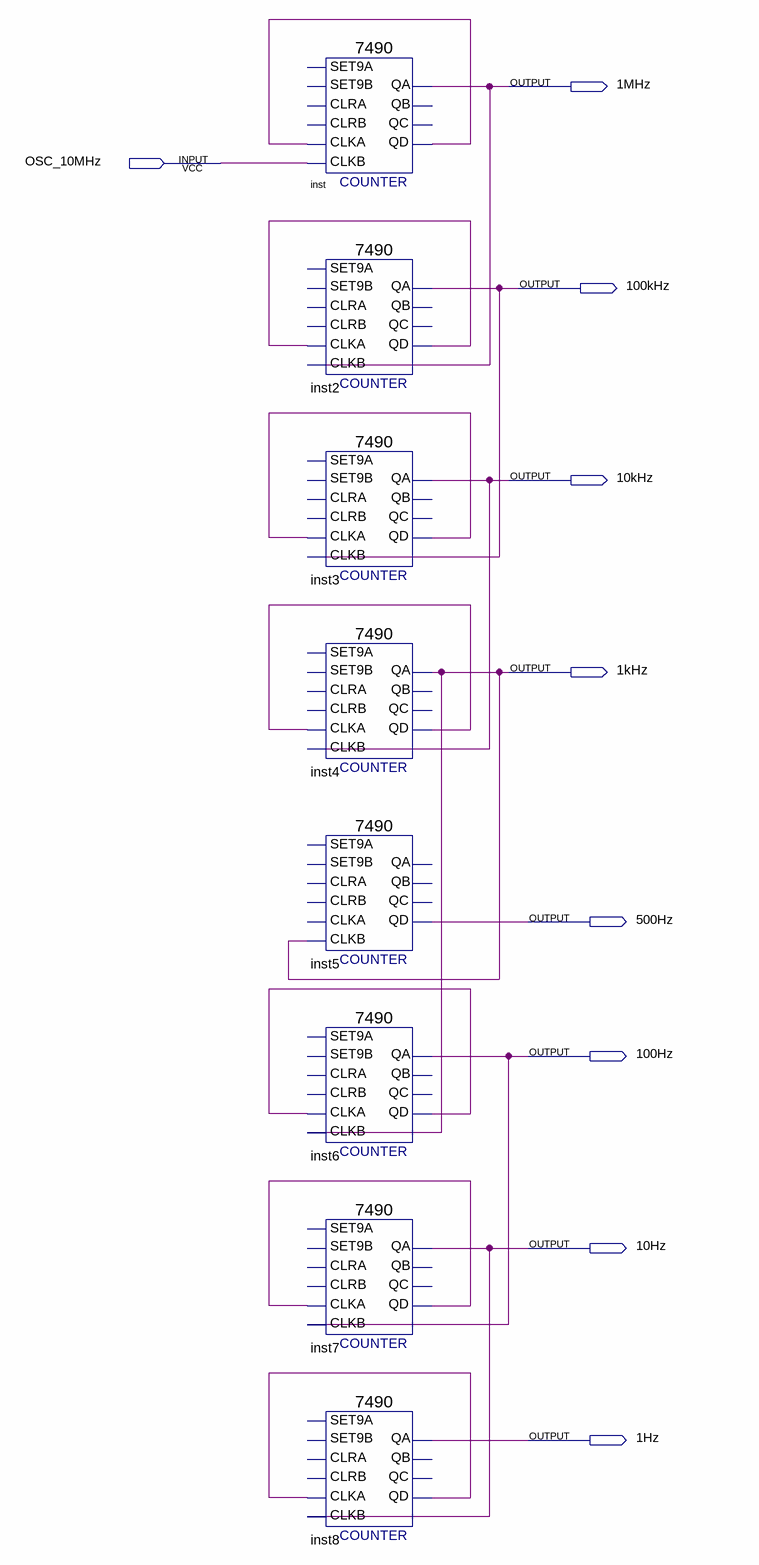
[diagram p0: schematic sheet]
// Quartus schematic FrequencyDivider.bdf as structural Verilog: 8 symbols, 9 pins
module FrequencyDivider (
  input  OSC_10MHz,
  output \1MHz ,
  output \100kHz ,
  output \10kHz ,
  output \1kHz ,
  output \500Hz ,
  output \100Hz ,
  output \10Hz ,
  output \1Hz 
);

  wire inst2_qd, inst3_qd, inst4_qd, inst6_qd, inst7_qd, inst8_qd, inst_qd;

  \7490  inst (.CLKB(OSC_10MHz), .CLKA(inst_qd), .QD(inst_qd), .QA(\1MHz ));  // open: SET9A, CLRA, SET9B, CLRB, QB, QC
  \7490  inst2 (
    .CLKB(\1MHz ), .CLKA(inst2_qd), .QD(inst2_qd), .QA(\100kHz ));  // open: SET9A, CLRA, SET9B, CLRB, QB, QC
  \7490  inst3 (
    .CLKB(\100kHz ), .CLKA(inst3_qd), .QD(inst3_qd), .QA(\10kHz ));  // open: SET9A, CLRA, SET9B, CLRB, QB, QC
  \7490  inst4 (.CLKB(\10kHz ), .CLKA(inst4_qd), .QD(inst4_qd), .QA(\1kHz ));  // open: SET9A, CLRA, SET9B, CLRB, QB, QC
  \7490  inst5 (.CLKB(\1kHz ), .QD(\500Hz ));  // open: SET9A, CLRA, SET9B, CLKA, CLRB, QA, QB, QC
  \7490  inst6 (.CLKB(\1kHz ), .CLKA(inst6_qd), .QD(inst6_qd), .QA(\100Hz ));  // open: SET9A, CLRA, SET9B, CLRB, QB, QC
  \7490  inst7 (.CLKB(\100Hz ), .CLKA(inst7_qd), .QD(inst7_qd), .QA(\10Hz ));  // open: SET9A, CLRA, SET9B, CLRB, QB, QC
  \7490  inst8 (.CLKB(\10Hz ), .CLKA(inst8_qd), .QD(inst8_qd), .QA(\1Hz ));  // open: SET9A, CLRA, SET9B, CLRB, QB, QC
endmodule
